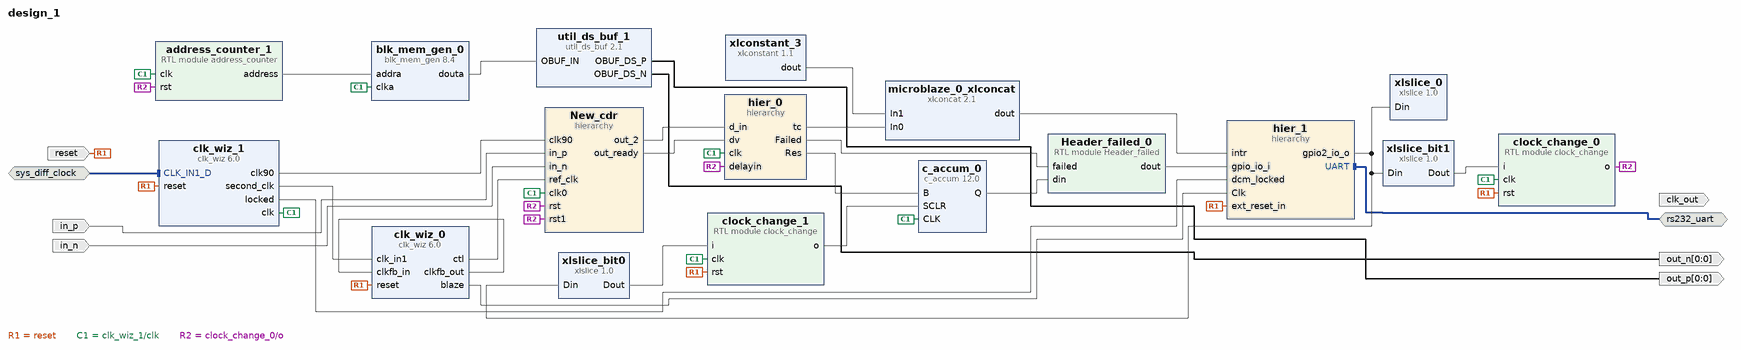
[diagram p0: block diagram of the top level]
# Vivado block design design_1, xc7vx485tffg1761-2, Vivado 2018.1
create_bd_design design_1

create_bd_intf_port -mode Slave -vlnv xilinx.com:interface:diff_clock_rtl:1.0 sys_diff_clock
set_property -dict {CONFIG.FREQ_HZ 200000000} [get_bd_intf_ports sys_diff_clock]
create_bd_intf_port -mode Master -vlnv xilinx.com:interface:uart_rtl:1.0 rs232_uart
create_bd_port -dir O -type clk clk_out
create_bd_port -dir I -type rst reset
set_property -dict {CONFIG.POLARITY ACTIVE_HIGH} [get_bd_ports reset]
create_bd_port -dir O -from 0 -to 0 out_p
create_bd_port -dir O -from 0 -to 0 out_n
create_bd_port -dir I in_p
create_bd_port -dir I in_n

create_bd_cell -type ip -vlnv xilinx.com:ip:xlslice:1.0 xlslice_0
set_property -dict {CONFIG.DIN_TO 2 CONFIG.DIN_FROM 9 CONFIG.DIN_WIDTH 10 CONFIG.DOUT_WIDTH 8} [get_bd_cells xlslice_0]
create_bd_cell -type ip -vlnv xilinx.com:ip:xlslice:1.0 xlslice_bit1
set_property -dict {CONFIG.DIN_TO 0 CONFIG.DIN_FROM 0 CONFIG.DIN_WIDTH 10 CONFIG.DOUT_WIDTH 1} [get_bd_cells xlslice_bit1]
create_bd_cell -type ip -vlnv xilinx.com:ip:xlslice:1.0 xlslice_bit0
set_property -dict {CONFIG.DIN_TO 1 CONFIG.DIN_FROM 1 CONFIG.DIN_WIDTH 10 CONFIG.DOUT_WIDTH 1} [get_bd_cells xlslice_bit0]
create_bd_cell -type ip -vlnv xilinx.com:ip:xlconcat:2.1 microblaze_0_xlconcat
create_bd_cell -type hier hier_0
create_bd_cell -type hier hier_1
create_bd_cell -type ip -vlnv xilinx.com:ip:blk_mem_gen:8.4 blk_mem_gen_0
set_property -dict [list \
  CONFIG.Memory_Type Single_Port_ROM \
  CONFIG.Enable_32bit_Address false \
  CONFIG.Write_Width_A 1 \
  CONFIG.Write_Depth_A 14400 \
  CONFIG.Enable_A Always_Enabled \
  CONFIG.Register_PortA_Output_of_Memory_Primitives true \
  CONFIG.Load_Init_File true \
  CONFIG.Coe_File ../../../../../../5b_bitstream_copy.coe \
  CONFIG.Use_RSTA_Pin false \
  CONFIG.Port_A_Write_Rate 0 \
  CONFIG.use_bram_block Stand_Alone \
] [get_bd_cells blk_mem_gen_0]
create_bd_cell -type hier New_cdr
create_bd_cell -type ip -vlnv xilinx.com:ip:clk_wiz:6.0 clk_wiz_1
set_property -dict [list \
  CONFIG.ENABLE_CLOCK_MONITOR false \
  CONFIG.PRIMITIVE MMCM \
  CONFIG.USE_DYN_RECONFIG false \
  CONFIG.PRIM_IN_FREQ 200.000 \
  CONFIG.CLKIN1_JITTER_PS 50.0 \
  CONFIG.CLKOUT2_USED true \
  CONFIG.CLKOUT3_USED true \
  CONFIG.CLKOUT4_USED true \
  CONFIG.CLKOUT5_USED false \
  CONFIG.CLKOUT6_USED false \
  CONFIG.NUM_OUT_CLKS 4 \
  CONFIG.CLK_OUT1_PORT second_clk \
  CONFIG.CLK_OUT2_PORT clk \
  CONFIG.CLK_OUT3_PORT clk90 \
  CONFIG.CLK_OUT4_PORT blaze \
  CONFIG.CLK_OUT5_PORT clk_out5 \
  CONFIG.CLK_OUT6_PORT clk_out6 \
  CONFIG.CLKOUT1_REQUESTED_OUT_FREQ 80 \
  CONFIG.CLKOUT2_REQUESTED_OUT_FREQ 640 \
  CONFIG.CLKOUT3_REQUESTED_OUT_FREQ 640 \
  CONFIG.CLKOUT3_REQUESTED_PHASE 90 \
  CONFIG.CLKOUT4_REQUESTED_OUT_FREQ 160 \
  CONFIG.CLKOUT4_REQUESTED_PHASE 0 \
  CONFIG.CLKOUT5_REQUESTED_OUT_FREQ 100.000 \
  CONFIG.CLKOUT5_REQUESTED_PHASE 0.000 \
  CONFIG.CLKOUT6_REQUESTED_OUT_FREQ 100.000 \
  CONFIG.PRIM_SOURCE Differential_clock_capable_pin \
  CONFIG.MMCM_DIVCLK_DIVIDE 5 \
  CONFIG.MMCM_CLKFBOUT_MULT_F 32.000 \
  CONFIG.MMCM_CLKIN1_PERIOD 5.000 \
  CONFIG.MMCM_CLKIN2_PERIOD 10.000 \
  CONFIG.MMCM_CLKOUT0_DIVIDE_F 16.000 \
  CONFIG.MMCM_CLKOUT1_DIVIDE 2 \
  CONFIG.MMCM_CLKOUT2_DIVIDE 2 \
  CONFIG.MMCM_CLKOUT2_PHASE 90.000 \
  CONFIG.MMCM_CLKOUT3_DIVIDE 8 \
  CONFIG.MMCM_CLKOUT3_PHASE 0.000 \
  CONFIG.MMCM_CLKOUT4_DIVIDE 1 \
  CONFIG.MMCM_CLKOUT4_PHASE 0.000 \
  CONFIG.MMCM_CLKOUT5_DIVIDE 1 \
  CONFIG.USE_BOARD_FLOW true \
  CONFIG.CLK_IN1_BOARD_INTERFACE sys_diff_clock \
  CONFIG.RESET_BOARD_INTERFACE reset \
  CONFIG.CLKOUT1_JITTER 143.262 \
  CONFIG.CLKOUT1_PHASE_ERROR 154.081 \
  CONFIG.CLKOUT2_JITTER 102.510 \
  CONFIG.CLKOUT2_PHASE_ERROR 154.081 \
  CONFIG.CLKOUT3_JITTER 102.510 \
  CONFIG.CLKOUT3_PHASE_ERROR 154.081 \
  CONFIG.CLKOUT4_JITTER 128.042 \
  CONFIG.CLKOUT4_PHASE_ERROR 154.081 \
  CONFIG.CLKOUT5_JITTER 87.396 \
  CONFIG.CLKOUT5_PHASE_ERROR 97.786 \
  CONFIG.CLKOUT6_JITTER 87.396 \
  CONFIG.CLKOUT6_PHASE_ERROR 97.786 \
  CONFIG.AXI_DRP false \
  CONFIG.PHASE_DUTY_CONFIG false \
] [get_bd_cells clk_wiz_1]
create_bd_cell -type ip -vlnv xilinx.com:ip:util_ds_buf:2.1 util_ds_buf_1
set_property -dict {CONFIG.C_BUF_TYPE OBUFDS} [get_bd_cells util_ds_buf_1]
create_bd_cell -type ip -vlnv xilinx.com:ip:xlconstant:1.1 xlconstant_3
set_property -dict {CONFIG.CONST_VAL 0} [get_bd_cells xlconstant_3]
create_bd_cell -type module -reference address_counter address_counter_1
set_property -dict {CONFIG.terminalcount 14399} [get_bd_cells address_counter_1]
create_bd_cell -type module -reference clock_change clock_change_0
create_bd_cell -type module -reference clock_change clock_change_1
create_bd_cell -type ip -vlnv xilinx.com:ip:c_accum:12.0 c_accum_0
set_property -dict [list \
  CONFIG.Implementation DSP48 \
  CONFIG.Input_Type Unsigned \
  CONFIG.Input_Width 1 \
  CONFIG.Output_Width 32 \
  CONFIG.Latency_Configuration Automatic \
  CONFIG.SCLR true \
  CONFIG.Bypass false \
] [get_bd_cells c_accum_0]
create_bd_cell -type ip -vlnv xilinx.com:ip:clk_wiz:6.0 clk_wiz_0
set_property -dict [list \
  CONFIG.PRIM_IN_FREQ 80 \
  CONFIG.USE_INCLK_SWITCHOVER false \
  CONFIG.SECONDARY_SOURCE Single_ended_clock_capable_pin \
  CONFIG.CLKIN1_JITTER_PS 125.0 \
  CONFIG.CLKIN2_JITTER_PS 166.66 \
  CONFIG.CLKOUT2_USED true \
  CONFIG.NUM_OUT_CLKS 2 \
  CONFIG.CLK_OUT1_PORT blaze \
  CONFIG.CLK_OUT2_PORT ctl \
  CONFIG.CLKOUT1_REQUESTED_OUT_FREQ 200 \
  CONFIG.CLKOUT2_REQUESTED_OUT_FREQ 400.000 \
  CONFIG.PRIM_SOURCE No_buffer \
  CONFIG.FEEDBACK_SOURCE FDBK_ONCHIP \
  CONFIG.MMCM_DIVCLK_DIVIDE 1 \
  CONFIG.MMCM_CLKFBOUT_MULT_F 10.000 \
  CONFIG.MMCM_CLKIN1_PERIOD 12.500 \
  CONFIG.MMCM_CLKIN2_PERIOD 10.000 \
  CONFIG.MMCM_CLKOUT0_DIVIDE_F 4.000 \
  CONFIG.MMCM_CLKOUT1_DIVIDE 2 \
  CONFIG.RESET_BOARD_INTERFACE Custom \
  CONFIG.CLKOUT1_JITTER 136.374 \
  CONFIG.CLKOUT1_PHASE_ERROR 117.521 \
  CONFIG.CLKOUT2_JITTER 120.213 \
  CONFIG.CLKOUT2_PHASE_ERROR 117.521 \
] [get_bd_cells clk_wiz_0]
create_bd_cell -type module -reference Header_failed Header_failed_0

# ---- hierarchy /hier_0 ----
current_bd_instance /hier_0
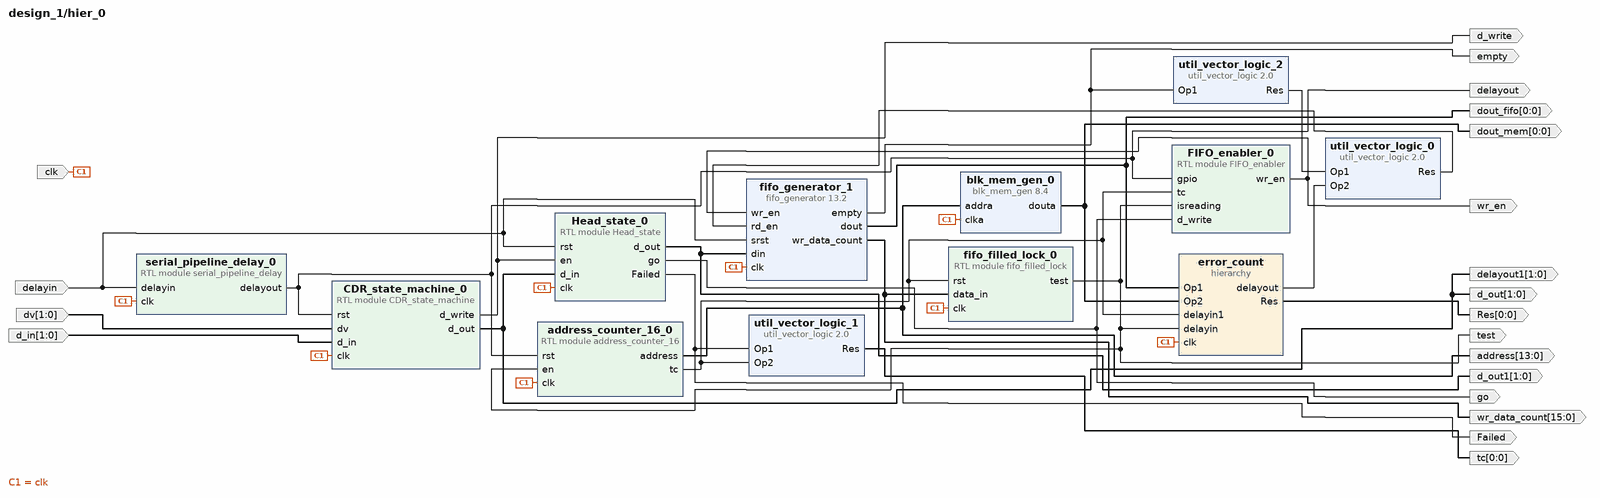
[diagram p1: block diagram inside /hier_0]
create_bd_pin -dir I -type clk clk
create_bd_pin -dir I delayin
create_bd_pin -dir I -from 1 -to 0 dv
create_bd_pin -dir I -from 1 -to 0 d_in
create_bd_pin -dir O -from 0 -to 0 tc
create_bd_pin -dir O -from 0 -to 0 dout_mem
create_bd_pin -dir O -from 0 -to 0 dout_fifo
create_bd_pin -dir O wr_en
create_bd_pin -dir O test
create_bd_pin -dir O empty
create_bd_pin -dir O d_write
create_bd_pin -dir O delayout
create_bd_pin -dir O -from 15 -to 0 wr_data_count
create_bd_pin -dir O -from 13 -to 0 address
create_bd_pin -dir O -from 0 -to 0 Res
create_bd_pin -dir O -from 1 -to 0 d_out
create_bd_pin -dir O -from 1 -to 0 delayout1
create_bd_pin -dir O -from 1 -to 0 d_out1
create_bd_pin -dir O go
create_bd_pin -dir O Failed

create_bd_cell -type ip -vlnv xilinx.com:ip:util_vector_logic:2.0 util_vector_logic_0
set_property -dict {CONFIG.C_SIZE 1} [get_bd_cells util_vector_logic_0]
create_bd_cell -type ip -vlnv xilinx.com:ip:util_vector_logic:2.0 util_vector_logic_2
set_property -dict {CONFIG.C_SIZE 1 CONFIG.C_OPERATION not} [get_bd_cells util_vector_logic_2]
create_bd_cell -type module -reference CDR_state_machine CDR_state_machine_0
create_bd_cell -type module -reference serial_pipeline_delay serial_pipeline_delay_0
set_property -dict {CONFIG.stages 20} [get_bd_cells serial_pipeline_delay_0]
create_bd_cell -type module -reference FIFO_enabler FIFO_enabler_0
create_bd_cell -type module -reference address_counter_16 address_counter_16_0
set_property -dict {CONFIG.terminalcount 14400} [get_bd_cells address_counter_16_0]
create_bd_cell -type hier error_count
create_bd_cell -type ip -vlnv xilinx.com:ip:blk_mem_gen:8.4 blk_mem_gen_0
set_property -dict [list \
  CONFIG.Memory_Type Single_Port_ROM \
  CONFIG.Enable_32bit_Address false \
  CONFIG.Write_Width_A 1 \
  CONFIG.Write_Depth_A 14400 \
  CONFIG.Enable_A Always_Enabled \
  CONFIG.Register_PortA_Output_of_Memory_Primitives true \
  CONFIG.Load_Init_File true \
  CONFIG.Coe_File ../../../../../../5b_bitstream_copy.coe \
  CONFIG.Use_RSTA_Pin false \
  CONFIG.Port_A_Write_Rate 0 \
  CONFIG.use_bram_block Stand_Alone \
] [get_bd_cells blk_mem_gen_0]
create_bd_cell -type ip -vlnv xilinx.com:ip:util_vector_logic:2.0 util_vector_logic_1
set_property -dict {CONFIG.C_SIZE 1 CONFIG.C_OPERATION or} [get_bd_cells util_vector_logic_1]
create_bd_cell -type module -reference Head_state Head_state_0
create_bd_cell -type module -reference fifo_filled_lock fifo_filled_lock_0
create_bd_cell -type ip -vlnv xilinx.com:ip:fifo_generator:13.2 fifo_generator_1
set_property -dict [list \
  CONFIG.Input_Data_Width 2 \
  CONFIG.Input_Depth 32768 \
  CONFIG.Output_Data_Width 1 \
  CONFIG.Write_Data_Count true \
  CONFIG.Write_Data_Count_Width 16 \
] [get_bd_cells fifo_generator_1]

# ---- hierarchy /hier_0/error_count ----
current_bd_instance /hier_0/error_count
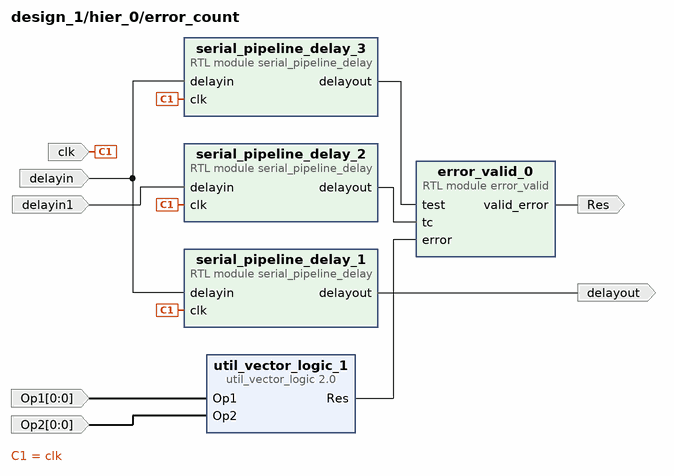
[diagram p2: block diagram inside /hier_0/error_count]
create_bd_pin -dir I -from 0 -to 0 Op1
create_bd_pin -dir I -from 0 -to 0 Op2
create_bd_pin -dir I -type clk clk
create_bd_pin -dir I delayin
create_bd_pin -dir I delayin1
create_bd_pin -dir O delayout
create_bd_pin -dir O Res

create_bd_cell -type ip -vlnv xilinx.com:ip:util_vector_logic:2.0 util_vector_logic_1
set_property -dict {CONFIG.C_SIZE 1 CONFIG.C_OPERATION xor} [get_bd_cells util_vector_logic_1]
create_bd_cell -type module -reference serial_pipeline_delay serial_pipeline_delay_3
create_bd_cell -type module -reference serial_pipeline_delay serial_pipeline_delay_2
set_property -dict {CONFIG.stages 1} [get_bd_cells serial_pipeline_delay_2]
create_bd_cell -type module -reference serial_pipeline_delay serial_pipeline_delay_1
set_property -dict {CONFIG.stages 0} [get_bd_cells serial_pipeline_delay_1]
create_bd_cell -type module -reference error_valid error_valid_0

# ---- hierarchy /hier_1 ----
current_bd_instance /hier_1
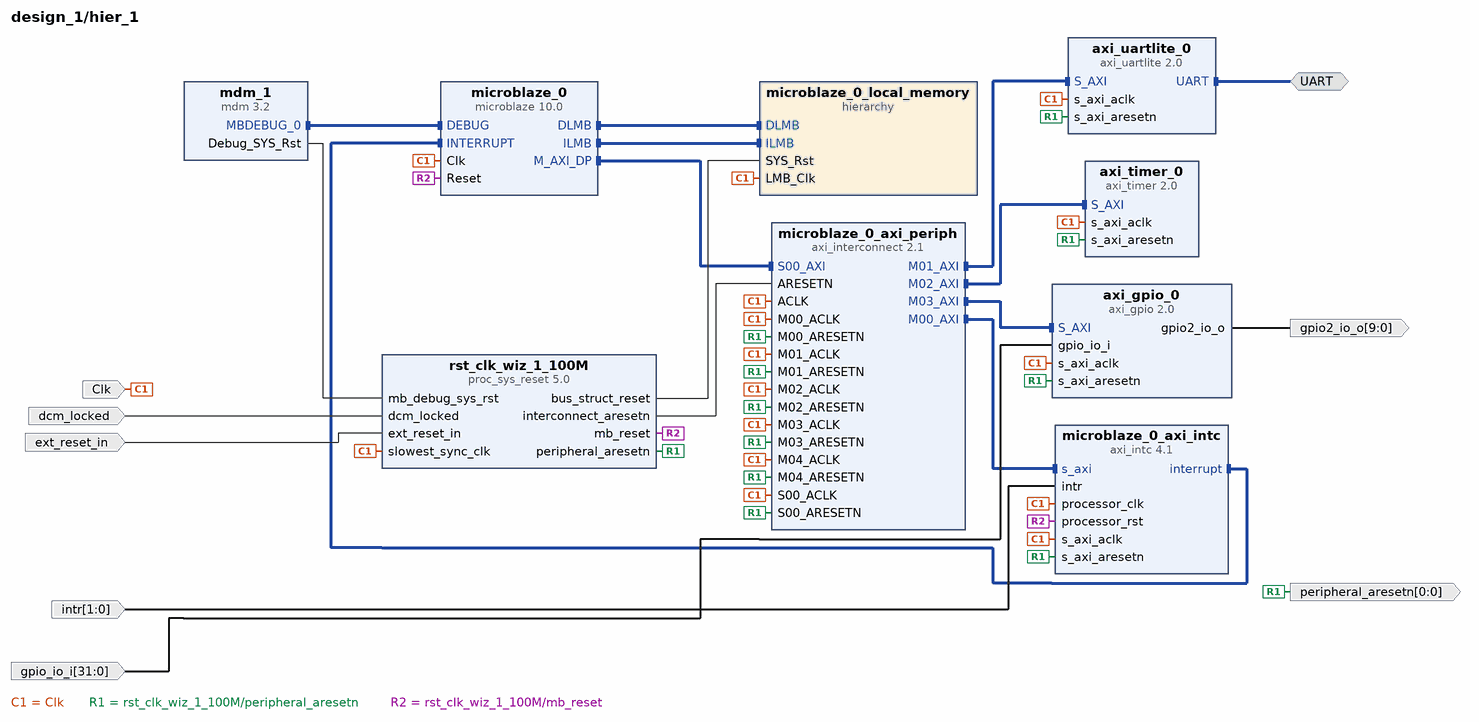
[diagram p3: block diagram inside /hier_1]
create_bd_intf_pin -mode Master -vlnv xilinx.com:interface:uart_rtl:1.0 UART
create_bd_pin -dir I -type clk Clk
create_bd_pin -dir I -from 31 -to 0 gpio_io_i
create_bd_pin -dir O -from 9 -to 0 gpio2_io_o
create_bd_pin -dir I -from 1 -to 0 -type intr intr
create_bd_pin -dir I dcm_locked
create_bd_pin -dir O -from 0 -to 0 -type rst peripheral_aresetn
create_bd_pin -dir I -type rst ext_reset_in

create_bd_cell -type ip -vlnv xilinx.com:ip:axi_intc:4.1 microblaze_0_axi_intc
set_property -dict {CONFIG.C_HAS_FAST 1} [get_bd_cells microblaze_0_axi_intc]
create_bd_cell -type hier microblaze_0_local_memory
create_bd_cell -type ip -vlnv xilinx.com:ip:proc_sys_reset:5.0 rst_clk_wiz_1_100M
set_property -dict {CONFIG.USE_BOARD_FLOW true CONFIG.RESET_BOARD_INTERFACE reset} [get_bd_cells rst_clk_wiz_1_100M]
create_bd_cell -type ip -vlnv xilinx.com:ip:axi_gpio:2.0 axi_gpio_0
set_property -dict [list \
  CONFIG.C_GPIO_WIDTH 32 \
  CONFIG.C_GPIO2_WIDTH 10 \
  CONFIG.C_IS_DUAL 1 \
  CONFIG.C_ALL_INPUTS 1 \
  CONFIG.USE_BOARD_FLOW true \
  CONFIG.GPIO_BOARD_INTERFACE Custom \
  CONFIG.GPIO2_BOARD_INTERFACE Custom \
  CONFIG.C_ALL_OUTPUTS_2 1 \
] [get_bd_cells axi_gpio_0]
create_bd_cell -type ip -vlnv xilinx.com:ip:axi_timer:2.0 axi_timer_0
create_bd_cell -type ip -vlnv xilinx.com:ip:axi_uartlite:2.0 axi_uartlite_0
set_property -dict [list \
  CONFIG.C_S_AXI_ACLK_FREQ_HZ 200000000 \
  CONFIG.USE_BOARD_FLOW true \
  CONFIG.UARTLITE_BOARD_INTERFACE rs232_uart \
] [get_bd_cells axi_uartlite_0]
create_bd_cell -type ip -vlnv xilinx.com:ip:mdm:3.2 mdm_1
create_bd_cell -type ip -vlnv xilinx.com:ip:microblaze:10.0 microblaze_0
set_property -dict {CONFIG.C_D_AXI 1 CONFIG.C_D_LMB 1 CONFIG.C_I_LMB 1 CONFIG.C_DEBUG_ENABLED 1} [get_bd_cells microblaze_0]
create_bd_cell -type ip -vlnv xilinx.com:ip:axi_interconnect:2.1 microblaze_0_axi_periph
set_property -dict {CONFIG.NUM_SI 1 CONFIG.NUM_MI 5 CONFIG.SYNCHRONIZATION_STAGES 2} [get_bd_cells microblaze_0_axi_periph]

# ---- hierarchy /hier_1/microblaze_0_local_memory ----
current_bd_instance /hier_1/microblaze_0_local_memory
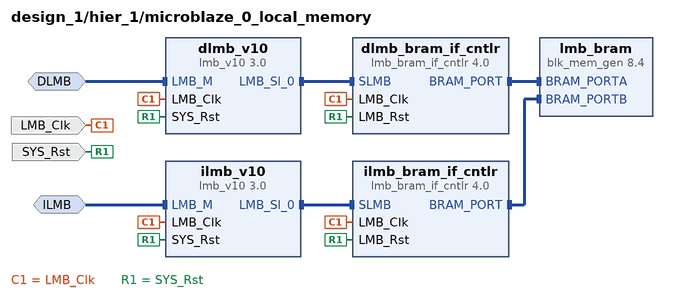
[diagram p4: block diagram inside /hier_1/microblaze_0_local_memory]
create_bd_intf_pin -mode MirroredMaster -vlnv xilinx.com:interface:lmb_rtl:1.0 DLMB
create_bd_intf_pin -mode MirroredMaster -vlnv xilinx.com:interface:lmb_rtl:1.0 ILMB
create_bd_pin -dir I -type clk LMB_Clk
create_bd_pin -dir I -type rst SYS_Rst

create_bd_cell -type ip -vlnv xilinx.com:ip:lmb_v10:3.0 dlmb_v10
create_bd_cell -type ip -vlnv xilinx.com:ip:lmb_v10:3.0 ilmb_v10
create_bd_cell -type ip -vlnv xilinx.com:ip:lmb_bram_if_cntlr:4.0 dlmb_bram_if_cntlr
set_property -dict {CONFIG.C_ECC 0} [get_bd_cells dlmb_bram_if_cntlr]
create_bd_cell -type ip -vlnv xilinx.com:ip:lmb_bram_if_cntlr:4.0 ilmb_bram_if_cntlr
set_property -dict {CONFIG.C_ECC 0} [get_bd_cells ilmb_bram_if_cntlr]
create_bd_cell -type ip -vlnv xilinx.com:ip:blk_mem_gen:8.4 lmb_bram
set_property -dict [list \
  CONFIG.Memory_Type True_Dual_Port_RAM \
  CONFIG.Enable_B Use_ENB_Pin \
  CONFIG.Use_RSTB_Pin true \
  CONFIG.Port_B_Clock 100 \
  CONFIG.Port_B_Write_Rate 50 \
  CONFIG.Port_B_Enable_Rate 100 \
  CONFIG.use_bram_block BRAM_Controller \
  CONFIG.EN_SAFETY_CKT false \
] [get_bd_cells lmb_bram]

# ---- hierarchy /New_cdr ----
current_bd_instance /New_cdr
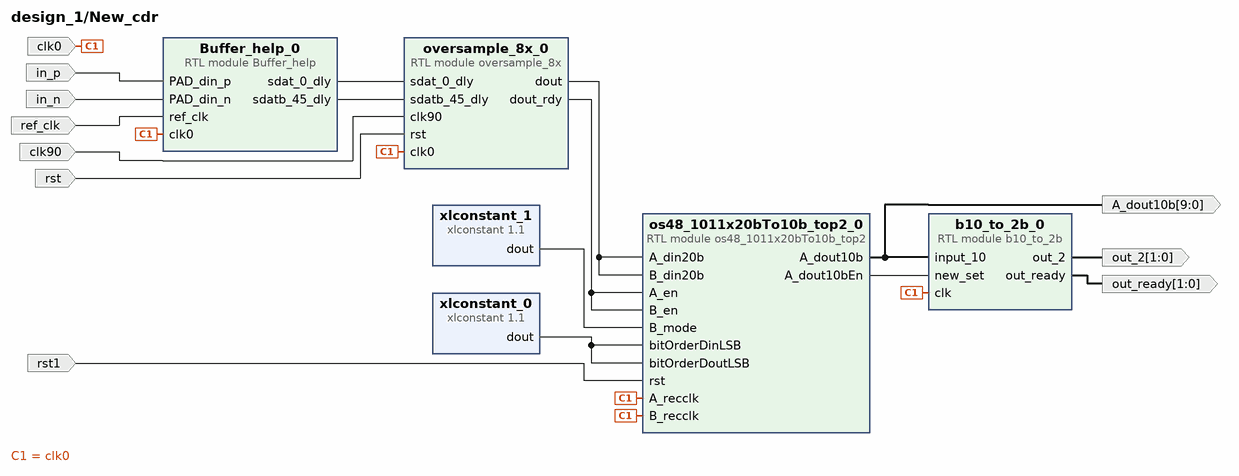
[diagram p5: block diagram inside /New_cdr]
create_bd_pin -dir I in_p
create_bd_pin -dir I in_n
create_bd_pin -dir I clk0
create_bd_pin -dir I clk90
create_bd_pin -dir O -from 1 -to 0 out_2
create_bd_pin -dir O -from 1 -to 0 out_ready
create_bd_pin -dir O -from 9 -to 0 A_dout10b
create_bd_pin -dir I -type rst rst1
create_bd_pin -dir I -type rst rst
create_bd_pin -dir I -type clk ref_clk

create_bd_cell -type module -reference b10_to_2b b10_to_2b_0
create_bd_cell -type ip -vlnv xilinx.com:ip:xlconstant:1.1 xlconstant_0
create_bd_cell -type ip -vlnv xilinx.com:ip:xlconstant:1.1 xlconstant_1
set_property -dict {CONFIG.CONST_WIDTH 2 CONFIG.CONST_VAL 01} [get_bd_cells xlconstant_1]
create_bd_cell -type module -reference oversample_8x oversample_8x_0
create_bd_cell -type module -reference os48_1011x20bTo10b_top2 os48_1011x20bTo10b_top2_0
create_bd_cell -type module -reference Buffer_help Buffer_help_0

# ---- connections ----

current_bd_instance /hier_0
connect_bd_net [get_bd_pins clk] \
  [get_bd_pins CDR_state_machine_0/clk] [get_bd_pins serial_pipeline_delay_0/clk] [get_bd_pins address_counter_16_0/clk] \
  [get_bd_pins blk_mem_gen_0/clka] [get_bd_pins Head_state_0/clk] [get_bd_pins fifo_filled_lock_0/clk] \
  [get_bd_pins fifo_generator_1/clk] [get_bd_pins error_count/clk]
connect_bd_net [get_bd_pins serial_pipeline_delay_0/delayout] \
  [get_bd_pins delayout] [get_bd_pins CDR_state_machine_0/rst] [get_bd_pins FIFO_enabler_0/gpio] \
  [get_bd_pins address_counter_16_0/rst]
connect_bd_net [get_bd_pins delayin] [get_bd_pins serial_pipeline_delay_0/delayin] [get_bd_pins Head_state_0/rst] [get_bd_pins fifo_generator_1/srst]
connect_bd_net [get_bd_pins dv] [get_bd_pins CDR_state_machine_0/dv]
connect_bd_net [get_bd_pins d_in] [get_bd_pins CDR_state_machine_0/d_in]
connect_bd_net [get_bd_pins CDR_state_machine_0/d_write] [get_bd_pins d_write] [get_bd_pins Head_state_0/en]
connect_bd_net [get_bd_pins FIFO_enabler_0/wr_en] [get_bd_pins wr_en] [get_bd_pins fifo_generator_1/wr_en]
connect_bd_net -net fifo_generator_0_empty [get_bd_pins fifo_generator_1/empty] [get_bd_pins empty] [get_bd_pins util_vector_logic_2/Op1]
connect_bd_net [get_bd_pins fifo_filled_lock_0/test] \
  [get_bd_pins test] [get_bd_pins FIFO_enabler_0/isreading] [get_bd_pins address_counter_16_0/en] \
  [get_bd_pins error_count/delayin]
connect_bd_net [get_bd_pins util_vector_logic_0/Res] [get_bd_pins fifo_generator_1/rd_en]
connect_bd_net -net fifo_generator_0_wr_data_count [get_bd_pins fifo_generator_1/wr_data_count] \
  [get_bd_pins wr_data_count] [get_bd_pins fifo_filled_lock_0/data_in]
connect_bd_net [get_bd_pins address_counter_16_0/tc] \
  [get_bd_pins FIFO_enabler_0/tc] [get_bd_pins util_vector_logic_1/Op2] [get_bd_pins fifo_filled_lock_0/rst] \
  [get_bd_pins error_count/delayin1]
connect_bd_net [get_bd_pins address_counter_16_0/address] [get_bd_pins address] [get_bd_pins blk_mem_gen_0/addra]
connect_bd_net [get_bd_pins blk_mem_gen_0/douta] [get_bd_pins dout_mem] [get_bd_pins error_count/Op2]
connect_bd_net -net fifo_generator_0_dout [get_bd_pins fifo_generator_1/dout] [get_bd_pins dout_fifo] [get_bd_pins error_count/Op1]
connect_bd_net [get_bd_pins util_vector_logic_2/Res] [get_bd_pins util_vector_logic_0/Op1]
connect_bd_net [get_bd_pins CDR_state_machine_0/d_out] [get_bd_pins delayout1] [get_bd_pins d_out] [get_bd_pins Head_state_0/d_in]
connect_bd_net [get_bd_pins error_count/delayout] [get_bd_pins util_vector_logic_0/Op2]
connect_bd_net [get_bd_pins Head_state_0/d_out] [get_bd_pins d_out1] [get_bd_pins fifo_generator_1/din]
connect_bd_net [get_bd_pins Head_state_0/go] [get_bd_pins go] [get_bd_pins FIFO_enabler_0/d_write]
connect_bd_net [get_bd_pins Head_state_0/Failed] [get_bd_pins Failed] [get_bd_pins util_vector_logic_1/Op1]
connect_bd_net [get_bd_pins util_vector_logic_1/Res] [get_bd_pins tc]
connect_bd_net [get_bd_pins error_count/Res] [get_bd_pins Res]

current_bd_instance /hier_0/error_count
connect_bd_net -net fifo_generator_0_dout [get_bd_pins Op1] [get_bd_pins util_vector_logic_1/Op1]
connect_bd_net -net blk_mem_gen_0_douta [get_bd_pins Op2] [get_bd_pins util_vector_logic_1/Op2]
connect_bd_net [get_bd_pins clk] \
  [get_bd_pins serial_pipeline_delay_2/clk] [get_bd_pins serial_pipeline_delay_3/clk] \
  [get_bd_pins serial_pipeline_delay_1/clk]
connect_bd_net [get_bd_pins delayin] [get_bd_pins serial_pipeline_delay_3/delayin] [get_bd_pins serial_pipeline_delay_1/delayin]
connect_bd_net [get_bd_pins delayin1] [get_bd_pins serial_pipeline_delay_2/delayin]
connect_bd_net [get_bd_pins serial_pipeline_delay_1/delayout] [get_bd_pins delayout]
connect_bd_net [get_bd_pins util_vector_logic_1/Res] [get_bd_pins error_valid_0/error]
connect_bd_net [get_bd_pins serial_pipeline_delay_2/delayout] [get_bd_pins error_valid_0/tc]
connect_bd_net [get_bd_pins serial_pipeline_delay_3/delayout] [get_bd_pins error_valid_0/test]
connect_bd_net [get_bd_pins error_valid_0/valid_error] [get_bd_pins Res]

current_bd_instance /hier_1
connect_bd_intf_net -intf_net h_microblaze_M03_AXI [get_bd_intf_pins axi_gpio_0/S_AXI] [get_bd_intf_pins microblaze_0_axi_periph/M03_AXI]
connect_bd_intf_net [get_bd_intf_pins microblaze_0_axi_periph/M02_AXI] [get_bd_intf_pins axi_timer_0/S_AXI]
connect_bd_intf_net [get_bd_intf_pins microblaze_0_axi_periph/M01_AXI] [get_bd_intf_pins axi_uartlite_0/S_AXI]
connect_bd_intf_net [get_bd_intf_pins mdm_1/MBDEBUG_0] [get_bd_intf_pins microblaze_0/DEBUG]
connect_bd_intf_net [get_bd_intf_pins microblaze_0_axi_intc/interrupt] [get_bd_intf_pins microblaze_0/INTERRUPT]
connect_bd_intf_net [get_bd_intf_pins microblaze_0/DLMB] [get_bd_intf_pins microblaze_0_local_memory/DLMB]
connect_bd_intf_net [get_bd_intf_pins microblaze_0/ILMB] [get_bd_intf_pins microblaze_0_local_memory/ILMB]
connect_bd_intf_net -intf_net microblaze_0_axi_dp [get_bd_intf_pins microblaze_0_axi_periph/S00_AXI] [get_bd_intf_pins microblaze_0/M_AXI_DP]
connect_bd_intf_net -intf_net microblaze_0_intc_axi [get_bd_intf_pins microblaze_0_axi_periph/M00_AXI] [get_bd_intf_pins microblaze_0_axi_intc/s_axi]
connect_bd_intf_net -intf_net h_microblaze_UART [get_bd_intf_pins UART] [get_bd_intf_pins axi_uartlite_0/UART]
connect_bd_net -net microblaze_0_Clk [get_bd_pins Clk] \
  [get_bd_pins microblaze_0_axi_intc/processor_clk] [get_bd_pins microblaze_0_axi_intc/s_axi_aclk] \
  [get_bd_pins rst_clk_wiz_1_100M/slowest_sync_clk] [get_bd_pins axi_gpio_0/s_axi_aclk] [get_bd_pins axi_timer_0/s_axi_aclk] \
  [get_bd_pins axi_uartlite_0/s_axi_aclk] [get_bd_pins microblaze_0/Clk] [get_bd_pins microblaze_0_local_memory/LMB_Clk] \
  [get_bd_pins microblaze_0_axi_periph/ACLK] [get_bd_pins microblaze_0_axi_periph/S00_ACLK] \
  [get_bd_pins microblaze_0_axi_periph/M00_ACLK] [get_bd_pins microblaze_0_axi_periph/M01_ACLK] \
  [get_bd_pins microblaze_0_axi_periph/M02_ACLK] [get_bd_pins microblaze_0_axi_periph/M03_ACLK] \
  [get_bd_pins microblaze_0_axi_periph/M04_ACLK]
connect_bd_net -net h_microblaze_peripheral_aresetn [get_bd_pins rst_clk_wiz_1_100M/peripheral_aresetn] \
  [get_bd_pins peripheral_aresetn] [get_bd_pins microblaze_0_axi_intc/s_axi_aresetn] [get_bd_pins axi_gpio_0/s_axi_aresetn] \
  [get_bd_pins axi_timer_0/s_axi_aresetn] [get_bd_pins axi_uartlite_0/s_axi_aresetn] \
  [get_bd_pins microblaze_0_axi_periph/S00_ARESETN] [get_bd_pins microblaze_0_axi_periph/M00_ARESETN] \
  [get_bd_pins microblaze_0_axi_periph/M01_ARESETN] [get_bd_pins microblaze_0_axi_periph/M02_ARESETN] \
  [get_bd_pins microblaze_0_axi_periph/M03_ARESETN] [get_bd_pins microblaze_0_axi_periph/M04_ARESETN]
connect_bd_net -net h_bert_Q [get_bd_pins gpio_io_i] [get_bd_pins axi_gpio_0/gpio_io_i]
connect_bd_net [get_bd_pins axi_gpio_0/gpio2_io_o] [get_bd_pins gpio2_io_o]
connect_bd_net [get_bd_pins rst_clk_wiz_1_100M/mb_reset] [get_bd_pins microblaze_0_axi_intc/processor_rst] [get_bd_pins microblaze_0/Reset]
connect_bd_net -net microblaze_0_xlconcat_dout [get_bd_pins intr] [get_bd_pins microblaze_0_axi_intc/intr]
connect_bd_net [get_bd_pins dcm_locked] [get_bd_pins rst_clk_wiz_1_100M/dcm_locked]
connect_bd_net [get_bd_pins mdm_1/Debug_SYS_Rst] [get_bd_pins rst_clk_wiz_1_100M/mb_debug_sys_rst]
connect_bd_net [get_bd_pins ext_reset_in] [get_bd_pins rst_clk_wiz_1_100M/ext_reset_in]
connect_bd_net -net ARESETN_1 [get_bd_pins rst_clk_wiz_1_100M/interconnect_aresetn] [get_bd_pins microblaze_0_axi_periph/ARESETN]
connect_bd_net -net SYS_Rst_1 [get_bd_pins rst_clk_wiz_1_100M/bus_struct_reset] [get_bd_pins microblaze_0_local_memory/SYS_Rst]

current_bd_instance /hier_1/microblaze_0_local_memory
connect_bd_intf_net -intf_net microblaze_0_dlmb_bus [get_bd_intf_pins dlmb_v10/LMB_Sl_0] [get_bd_intf_pins dlmb_bram_if_cntlr/SLMB]
connect_bd_intf_net -intf_net microblaze_0_ilmb_bus [get_bd_intf_pins ilmb_v10/LMB_Sl_0] [get_bd_intf_pins ilmb_bram_if_cntlr/SLMB]
connect_bd_intf_net -intf_net microblaze_0_dlmb_cntlr [get_bd_intf_pins dlmb_bram_if_cntlr/BRAM_PORT] [get_bd_intf_pins lmb_bram/BRAM_PORTA]
connect_bd_intf_net -intf_net microblaze_0_ilmb_cntlr [get_bd_intf_pins ilmb_bram_if_cntlr/BRAM_PORT] [get_bd_intf_pins lmb_bram/BRAM_PORTB]
connect_bd_intf_net -intf_net microblaze_0_dlmb [get_bd_intf_pins DLMB] [get_bd_intf_pins dlmb_v10/LMB_M]
connect_bd_intf_net -intf_net microblaze_0_ilmb [get_bd_intf_pins ILMB] [get_bd_intf_pins ilmb_v10/LMB_M]
connect_bd_net -net microblaze_0_Clk [get_bd_pins LMB_Clk] \
  [get_bd_pins dlmb_v10/LMB_Clk] [get_bd_pins ilmb_v10/LMB_Clk] [get_bd_pins dlmb_bram_if_cntlr/LMB_Clk] \
  [get_bd_pins ilmb_bram_if_cntlr/LMB_Clk]
connect_bd_net [get_bd_pins SYS_Rst] \
  [get_bd_pins dlmb_v10/SYS_Rst] [get_bd_pins ilmb_v10/SYS_Rst] [get_bd_pins dlmb_bram_if_cntlr/LMB_Rst] \
  [get_bd_pins ilmb_bram_if_cntlr/LMB_Rst]

current_bd_instance /New_cdr
connect_bd_net [get_bd_pins Buffer_help_0/sdat_0_dly] [get_bd_pins oversample_8x_0/sdat_0_dly]
connect_bd_net [get_bd_pins Buffer_help_0/sdatb_45_dly] [get_bd_pins oversample_8x_0/sdatb_45_dly]
connect_bd_net [get_bd_pins in_p] [get_bd_pins Buffer_help_0/PAD_din_p]
connect_bd_net [get_bd_pins in_n] [get_bd_pins Buffer_help_0/PAD_din_n]
connect_bd_net -net clk_wiz_1_clk [get_bd_pins clk0] \
  [get_bd_pins b10_to_2b_0/clk] [get_bd_pins oversample_8x_0/clk0] [get_bd_pins os48_1011x20bTo10b_top2_0/A_recclk] \
  [get_bd_pins os48_1011x20bTo10b_top2_0/B_recclk] [get_bd_pins Buffer_help_0/clk0]
connect_bd_net -net clk_wiz_1_clk90 [get_bd_pins clk90] [get_bd_pins oversample_8x_0/clk90]
connect_bd_net [get_bd_pins oversample_8x_0/dout] [get_bd_pins os48_1011x20bTo10b_top2_0/A_din20b] [get_bd_pins os48_1011x20bTo10b_top2_0/B_din20b]
connect_bd_net [get_bd_pins b10_to_2b_0/out_2] [get_bd_pins out_2]
connect_bd_net [get_bd_pins b10_to_2b_0/out_ready] [get_bd_pins out_ready]
connect_bd_net [get_bd_pins xlconstant_1/dout] [get_bd_pins os48_1011x20bTo10b_top2_0/B_mode]
connect_bd_net [get_bd_pins oversample_8x_0/dout_rdy] [get_bd_pins os48_1011x20bTo10b_top2_0/A_en] [get_bd_pins os48_1011x20bTo10b_top2_0/B_en]
connect_bd_net [get_bd_pins xlconstant_0/dout] \
  [get_bd_pins os48_1011x20bTo10b_top2_0/bitOrderDinLSB] [get_bd_pins os48_1011x20bTo10b_top2_0/bitOrderDoutLSB]
connect_bd_net [get_bd_pins os48_1011x20bTo10b_top2_0/A_dout10bEn] [get_bd_pins b10_to_2b_0/new_set]
connect_bd_net [get_bd_pins os48_1011x20bTo10b_top2_0/A_dout10b] [get_bd_pins A_dout10b] [get_bd_pins b10_to_2b_0/input_10]
connect_bd_net -net rst1_1 [get_bd_pins rst1] [get_bd_pins os48_1011x20bTo10b_top2_0/rst]
connect_bd_net [get_bd_pins rst] [get_bd_pins oversample_8x_0/rst]
connect_bd_net [get_bd_pins ref_clk] [get_bd_pins Buffer_help_0/ref_clk]

current_bd_instance /
connect_bd_intf_net [get_bd_intf_ports sys_diff_clock] [get_bd_intf_pins clk_wiz_1/CLK_IN1_D]
connect_bd_intf_net -intf_net h_microblaze_UART [get_bd_intf_ports rs232_uart] [get_bd_intf_pins hier_1/UART]
connect_bd_net [get_bd_ports reset] \
  [get_bd_pins clk_wiz_1/reset] [get_bd_pins clock_change_0/rst] [get_bd_pins clock_change_1/rst] \
  [get_bd_pins clk_wiz_0/reset] [get_bd_pins hier_1/ext_reset_in]
connect_bd_net -net axi_gpio_0_gpio2_io_o [get_bd_pins hier_1/gpio2_io_o] \
  [get_bd_pins xlslice_0/Din] [get_bd_pins xlslice_bit1/Din] [get_bd_pins xlslice_bit0/Din]
connect_bd_net [get_bd_pins clk_wiz_1/clk] \
  [get_bd_pins blk_mem_gen_0/clka] [get_bd_pins address_counter_1/clk] [get_bd_pins clock_change_0/clk] \
  [get_bd_pins clock_change_1/clk] [get_bd_pins c_accum_0/CLK] [get_bd_pins hier_0/clk] [get_bd_pins New_cdr/clk0]
connect_bd_net [get_bd_pins clk_wiz_1/clk90] [get_bd_pins New_cdr/clk90]
connect_bd_net [get_bd_pins microblaze_0_xlconcat/dout] [get_bd_pins hier_1/intr]
connect_bd_net [get_bd_pins xlconstant_3/dout] [get_bd_pins microblaze_0_xlconcat/In1]
connect_bd_net -net h_bert_douta [get_bd_pins blk_mem_gen_0/douta] [get_bd_pins util_ds_buf_1/OBUF_IN]
connect_bd_net [get_bd_pins util_ds_buf_1/OBUF_DS_P] [get_bd_ports out_p]
connect_bd_net [get_bd_pins util_ds_buf_1/OBUF_DS_N] [get_bd_ports out_n]
connect_bd_net -net address_counter_0_address [get_bd_pins address_counter_1/address] [get_bd_pins blk_mem_gen_0/addra]
connect_bd_net -net xlslice_bit1_Dout [get_bd_pins clock_change_0/o] \
  [get_bd_pins address_counter_1/rst] [get_bd_pins hier_0/delayin] [get_bd_pins New_cdr/rst] [get_bd_pins New_cdr/rst1]
connect_bd_net [get_bd_pins hier_0/tc] [get_bd_pins microblaze_0_xlconcat/In0]
connect_bd_net [get_bd_pins clk_wiz_1/locked] [get_bd_pins hier_1/dcm_locked]
connect_bd_net [get_bd_pins hier_0/Res] [get_bd_pins c_accum_0/B]
connect_bd_net [get_bd_ports in_p] [get_bd_pins New_cdr/in_p]
connect_bd_net [get_bd_ports in_n] [get_bd_pins New_cdr/in_n]
connect_bd_net -net dv_1 [get_bd_pins New_cdr/out_2] [get_bd_pins hier_0/d_in]
connect_bd_net -net d_in_1 [get_bd_pins New_cdr/out_ready] [get_bd_pins hier_0/dv]
connect_bd_net -net xlslice_bit0_Dout [get_bd_pins clock_change_1/o] [get_bd_pins c_accum_0/SCLR]
connect_bd_net [get_bd_pins xlslice_bit1/Dout] [get_bd_pins clock_change_0/i]
connect_bd_net [get_bd_pins xlslice_bit0/Dout] [get_bd_pins clock_change_1/i]
connect_bd_net [get_bd_pins clk_wiz_1/second_clk] [get_bd_pins clk_wiz_0/clk_in1]
connect_bd_net [get_bd_pins clk_wiz_0/ctl] [get_bd_pins New_cdr/ref_clk]
connect_bd_net [get_bd_pins clk_wiz_0/clkfb_out] [get_bd_pins clk_wiz_0/clkfb_in]
connect_bd_net [get_bd_pins clk_wiz_0/blaze] [get_bd_pins hier_1/Clk]
connect_bd_net [get_bd_pins c_accum_0/Q] [get_bd_pins Header_failed_0/din]
connect_bd_net [get_bd_pins Header_failed_0/dout] [get_bd_pins hier_1/gpio_io_i]
connect_bd_net [get_bd_pins hier_0/Failed] [get_bd_pins Header_failed_0/failed]

# ---- address map ----
assign_bd_address -offset 0x00000000 -range 64K -target_address_space [get_bd_addr_spaces hier_1/microblaze_0/Data] [get_bd_addr_segs hier_1/microblaze_0_local_memory/dlmb_bram_if_cntlr/SLMB/Mem]
assign_bd_address -offset 0x40000000 -range 64K -target_address_space [get_bd_addr_spaces hier_1/microblaze_0/Data] [get_bd_addr_segs hier_1/axi_gpio_0/S_AXI/Reg]
assign_bd_address -offset 0x40600000 -range 64K -target_address_space [get_bd_addr_spaces hier_1/microblaze_0/Data] [get_bd_addr_segs hier_1/axi_uartlite_0/S_AXI/Reg]
assign_bd_address -offset 0x41200000 -range 64K -target_address_space [get_bd_addr_spaces hier_1/microblaze_0/Data] [get_bd_addr_segs hier_1/microblaze_0_axi_intc/S_AXI/Reg]
assign_bd_address -offset 0x41C00000 -range 64K -target_address_space [get_bd_addr_spaces hier_1/microblaze_0/Data] [get_bd_addr_segs hier_1/axi_timer_0/S_AXI/Reg]
assign_bd_address -offset 0x00000000 -range 64K -target_address_space [get_bd_addr_spaces hier_1/microblaze_0/Instruction] [get_bd_addr_segs hier_1/microblaze_0_local_memory/ilmb_bram_if_cntlr/SLMB/Mem]

validate_bd_design
save_bd_design
